# Altium schematic sheet CLKs.SchDoc: CLKs
size 420 x 297 mm; Organization: Altium Limited; Address1: L3, 12a Rodborough Rd; Address2: Frenchs Forest; Address3: NSW; Address4: Australia 2086; DocumentNumber: 13; SheetNumber: 8; SheetTotal: 15
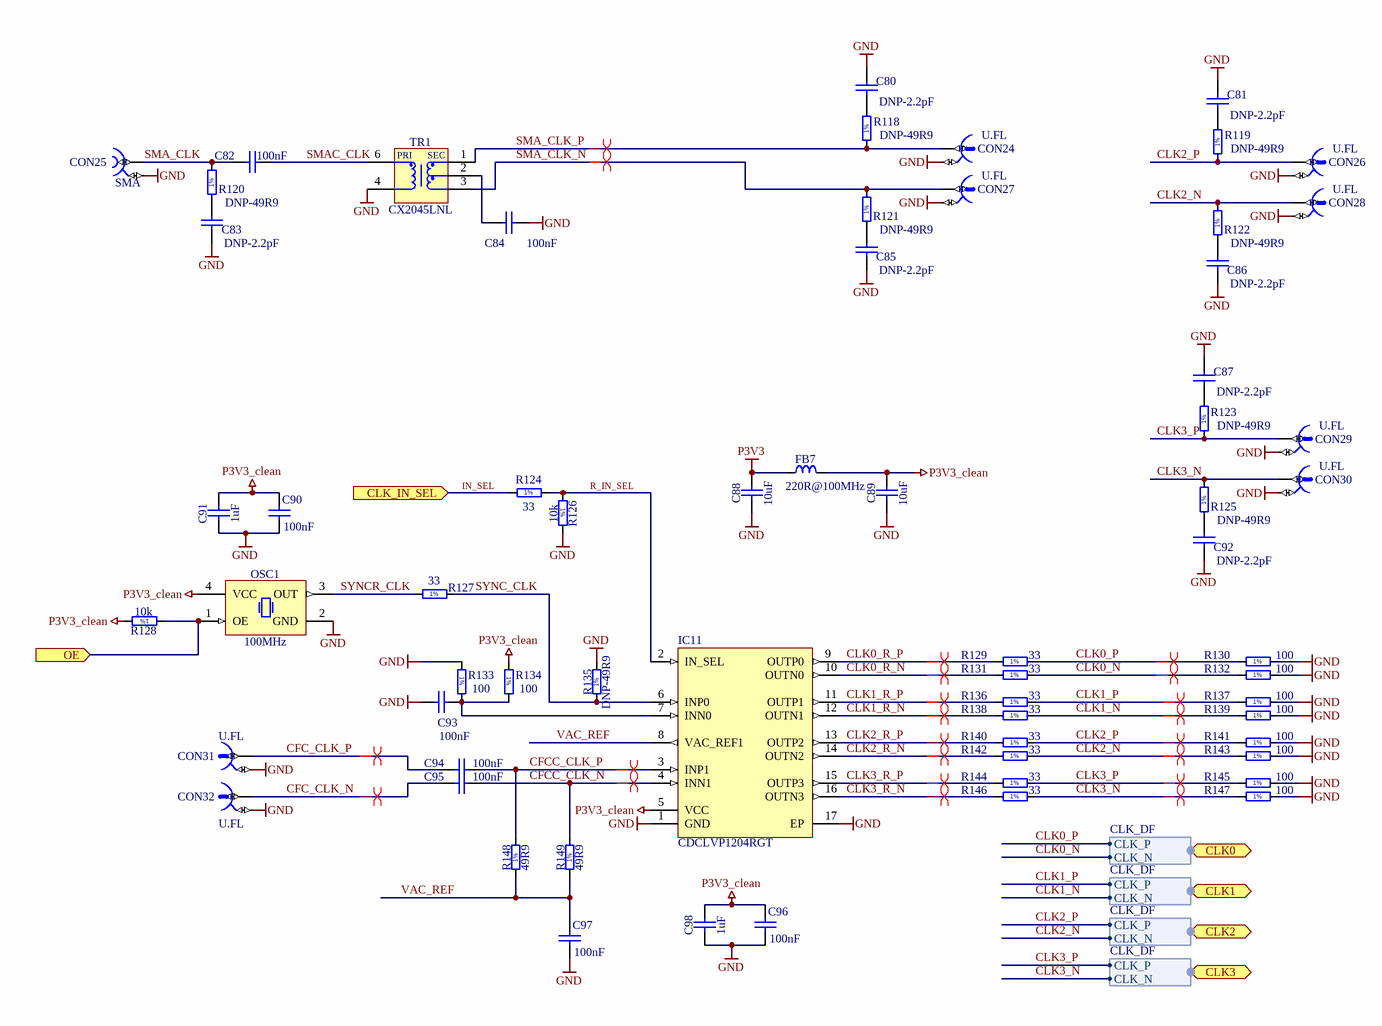
[diagram p0: CLKs.SchDoc]

## Parts
C80  DNP-2.2pF  [CAPC1005X55N]
C81  DNP-2.2pF  [CAPC1005X55N]
C82  100nF  [CAPC0603X33N]
C83  DNP-2.2pF  [CAPC1005X55N]
C84  100nF  [CAPC0603X33N]
C85  DNP-2.2pF  [CAPC1005X55N]
C86  DNP-2.2pF  [CAPC1005X55N]
C87  DNP-2.2pF  [CAPC1005X55N]
C88  10uF  [CAPC2012X135N]
C89  10uF  [CAPC2012X135N]
C90  100nF  [CAPC0603X33N]
C91  1uF  [CAPC1608X87N]
C92  DNP-2.2pF  [CAPC1005X55N]
C93  100nF  [CAPC1005X55N]
C94  100nF  [CAPC0603X33N]
C95  100nF  [CAPC0603X33N]
C96  100nF  [CAPC0603X33N]
C97  100nF  [CAPC1005X55N]
C98  1uF  [CAPC1608X87N]
CON24  U.FL  [HIROSE_U.FL-R-SMT-1(10)]
CON25  SMA  [HUBER-SUHNER_85 SMA-50-0-101/111 NE]
CON26  U.FL  [HIROSE_U.FL-R-SMT-1(10)]
CON27  U.FL  [HIROSE_U.FL-R-SMT-1(10)]
CON28  U.FL  [HIROSE_U.FL-R-SMT-1(10)]
CON29  U.FL  [HIROSE_U.FL-R-SMT-1(10)]
CON30  U.FL  [HIROSE_U.FL-R-SMT-1(10)]
CON31  U.FL  [HIROSE_U.FL-R-SMT-1(10)]
CON32  U.FL  [HIROSE_U.FL-R-SMT-1(10)]
FB7  220R@100MHz  [INDC2012X105N]
IC11  CDCLVP1204RGT  [QFN50P300X300X100-17N-S165]
OSC1  100MHz  [OSC_EPSON_SG-8002CA]
R118  DNP-49R9  [RESC1005X40N]
R119  DNP-49R9  [RESC1005X40N]
R120  DNP-49R9  [RESC1005X40N]
R121  DNP-49R9  [RESC1005X40N]
R122  DNP-49R9  [RESC1005X40N]
R123  DNP-49R9  [RESC1005X40N]
R124  33  [RESC1005X40N]
R125  DNP-49R9  [RESC1005X40N]
R126  10k  [RESC1005X40N]
R127  33  [RESC1005X40N]
R128  10k  [RESC1005X40N]
R129  33  [RESC1005X40N]
R130  100  [RESC1005X40N]
R131  33  [RESC1005X40N]
R132  100  [RESC1005X40N]
R133  100  [RESC1005X40N]
R134  100  [RESC1005X40N]
R135  DNP-49R9  [RESC1005X40N]
R136  33  [RESC1005X40N]
R137  100  [RESC1005X40N]
R138  33  [RESC1005X40N]
R139  100  [RESC1005X40N]
R140  33  [RESC1005X40N]
R141  100  [RESC1005X40N]
R142  33  [RESC1005X40N]
R143  100  [RESC1005X40N]
R144  33  [RESC1005X40N]
R145  100  [RESC1005X40N]
R146  33  [RESC1005X40N]
R147  100  [RESC1005X40N]
R148  49R9  [RESC1005X40N]
R149  49R9  [RESC1005X40N]
TR1  CX2045LNL  [PULSE_CX2045LNL]

## Ports
CLK0 (harness CLK_DF), CLK1 (harness CLK_DF), CLK2 (harness CLK_DF), CLK3 (harness CLK_DF), CLK_IN_SEL (in), OE (in)

## Harnesses
CLK_DF: CLK_P, CLK_N

## Nets
GND: C80.2 C81.2 C83.2 C84.1 C85.2 C86.2 C87.2 C88.1 C89.1 C90.1 C91.1 C92.2 C93.1 C96.1 C97.1 C98.1 CON24.2 CON25.2 CON26.2 CON27.2 CON28.2 CON29.2 CON30.2 CON31.2 CON32.2 IC11.1(GND) IC11.17(EP) OSC1.2(GND) R126.2 R130.2 R132.2 R133.1 R135.2 R137.2 R139.2 R141.2 R143.2 R145.2 R147.2 TR1.4
P3V3: C88.2 FB7.1
P3V3_clean: C89.2 C90.2 C91.2 C96.2 C98.2 FB7.2 IC11.5(VCC) OSC1.4(VCC) R128.2 R134.1
CFC_CLK_N: C95.2 CON32.1
CFC_CLK_P: C94.2 CON31.1
CFCC_CLK_N: C95.1 IC11.4(INN1) R149.2
CFCC_CLK_P: C94.1 IC11.3(INP1) R148.2
CLK0_N: R131.2 R132.1 ; port CLK0.CLK_N
CLK0_P: R129.2 R130.1 ; port CLK0.CLK_P
CLK0_R_N: IC11.10(OUTN0) R131.1
CLK0_R_P: IC11.9(OUTP0) R129.1
CLK1_N: R138.2 R139.1 ; port CLK1.CLK_N
CLK1_P: R136.2 R137.1 ; port CLK1.CLK_P
CLK1_R_N: IC11.12(OUTN1) R138.1
CLK1_R_P: IC11.11(OUTP1) R136.1
CLK2_N: CON28.1 R122.2 R142.2 R143.1 ; port CLK2.CLK_N
CLK2_P: CON26.1 R119.1 R140.2 R141.1 ; port CLK2.CLK_P
CLK2_R_N: IC11.14(OUTN2) R142.1
CLK2_R_P: IC11.13(OUTP2) R140.1
CLK3_N: CON30.1 R125.2 R146.2 R147.1 ; port CLK3.CLK_N
CLK3_P: CON29.1 R123.1 R144.2 R145.1 ; port CLK3.CLK_P
CLK3_R_N: IC11.16(OUTN3) R146.1
CLK3_R_P: IC11.15(OUTP3) R144.1
IN_SEL: R124.1 ; port CLK_IN_SEL
OE: OSC1.1(OE) R128.1 ; port OE
R_IN_SEL: IC11.2(IN_SEL) R124.2 R126.1
SMA_CLK: C82.2 CON25.1 R120.2
SMA_CLK_N: CON27.1 R121.2 TR1.3
SMA_CLK_P: CON24.1 R118.1 TR1.1
SMAC_CLK: C82.1 TR1.6
SYNC_CLK: IC11.6(INP0) R127.2 R135.1
SYNCR_CLK: OSC1.3(OUT) R127.1
VAC_REF: C97.2 IC11.8(VAC_REF1) R148.1 R149.1
NetC80_1: C80.1 R118.2
NetC81_1: C81.1 R119.2
NetC83_1: C83.1 R120.1
NetC84_2: C84.2 TR1.2
NetC85_1: C85.1 R121.1
NetC86_1: C86.1 R122.1
NetC87_1: C87.1 R123.2
NetC92_1: C92.1 R125.1
NetC93_2: C93.2 IC11.7(INN0) R133.2 R134.2

## Layout directives
differential pair: CFC_CLK_N, CFC_CLK_P, CFCC_CLK_N, CFCC_CLK_P, CLK0_N, CLK0_P, CLK0_R_N, CLK0_R_P, CLK1_N, CLK1_P, CLK1_R_N, CLK1_R_P, CLK2_N, CLK2_P, CLK2_R_N, CLK2_R_P, CLK3_N, CLK3_P, CLK3_R_N, CLK3_R_P, SMA_CLK_N, SMA_CLK_P

## Notes on the sheet
- Project/Equipment
- Document
- uTCA RTM 8 SFP+
- Designer
- Drawn by
- Check.by
- Copyright Creotech Instruments SA 2014.
  This documentation describes Open Hardware and is licensed under the CERN OHL v.1.1. You may redistribute and modify this documentation under the terms of the CERN OHL v.1.1. (http://ohwr.org/CERNOHL). This documentation is distributed WITHOUT ANY EXPRESS OR IMPLIED WARRANTY, INCLUDING OF MERCHANTABILITY, SATISFACTORY QUALITY AND FITNESS FOR A PARTICULAR PURPOSE. Please see the CERN OHL v.1.1 for applicable conditions.
- Creotech Instruments S.A.
- File
- Last Mod.
- Print Date
- Sheet
- Size
- A3
- of
- Rev
- (in symbol PULSE_CX2045LNL) PRI; SEC
- (in symbol R0402_10K_1%_0.0625W_100PPM) 1%
- (in symbol R0402_33R_1%_0.0625W_100PPM) 1%
- (in symbol R0402_49R9_1%_0.0625W_100PPM) 1%
- (in symbol R0402_100R_1%_0.0625W_100PPM) 1%

## Library data of the parts
C80 C81 C83 C85-C87 C92 = CC0402_2.2PF_50V_0.25PF_NP0: Non-polarised capacitor; Part Description: SMD Multilayer Chip Ceramic Capacitor; Manufacturer: GENERIC; Manufacturer1 Part Number: 223886915228; Voltage: 50V; TC: NP0; Tolerance: ±0.25pF; Table: Capacitors SMD; Part Number: CC0402_2.2PF_50V_0.25PF_NP0; Component Kind: Standard; Component Type: Standard; Pin Count: 2; Value: DNP-2.2pF; Status: Not Recommended; Manufacturer Part Number: CC0402_2.2PF_50V_0.25PF_NP0; Case: 0402; Mounted: Yes; Socket: No; SMD: Yes; Manufacturer1 Example: PHYCOMP; Manufacturer1 ComponentHeight: 0.55mm; HelpURL: \\cern.ch\dfs\Applications\Altium\Datasheets\CC0402_NP0_PHYCOMP.pdf; Author: CERN DEM JLC; CreateDate: 2007-12-03; LatestRevisionDate: 2007-12-03
C82 C84 C90 C94-C96 = CC0201_100NF_6.3V_10%_X5R: Non-polarised capacitor; Part Description: SMD Multilayer Chip Ceramic Capacitor; Manufacturer: GENERIC; Manufacturer1 Part Number: 02016D104KAT2A; Voltage: 6.3V; TC: X5R; Tolerance: ±10%; Table: Capacitors SMD; Part Number: CC0201_100NF_6.3V_10%_X5R; Component Kind: Standard; Component Type: Standard; Pin Count: 2; Value: 100nF; Status: Not Recommended; Manufacturer Part Number: CC0201_100NF_6.3V_10%_X5R; Case: 0201; Mounted: Yes; Socket: No; SMD: Yes; Manufacturer1 Example: AVX; Manufacturer1 ComponentHeight: 0.33mm; HelpURL: \\cern.ch\dfs\Applications\Altium\Datasheets\CC0201_X5R_AVX.pdf; Author: CERN DEM JLC; CreateDate: 2007-12-03; LatestRevisionDate: 2007-12-03
C88 C89 = CC0805_10UF_10V_10%_X7R: Non-polarised capacitor; Part Description: SMD Multilayer Chip Ceramic Capacitor; Manufacturer: GENERIC; Manufacturer1 Part Number: GRM21BR71A106KE51L; Voltage: 10V; TC: X7R; Tolerance: ±10%; Table: Capacitors SMD; Part Number: CC0805_10UF_10V_10%_X7R; Component Kind: Standard; Component Type: Standard; Pin Count: 2; Value: 10uF; Status: Preferred; Manufacturer Part Number: CC0805_10UF_10V_10%_X7R; Case: 0805; Mounted: Yes; Socket: No; SMD: Yes; Manufacturer1 Example: MURATA; Manufacturer1 ComponentHeight: 1.35mm; HelpURL: \\cern.ch\dfs\Applications\Altium\Datasheets\CC0805_X7R_MURATA.pdf; Author: CERN DEM JLC; CreateDate: 2012-04-30; LatestRevisionDate: 2012-04-30
C91 C98 = CC0603_1UF_25V_10%_X7R: Non-polarised capacitor; Part Description: SMD Multilayer Chip Ceramic Capacitor; Manufacturer: GENERIC; Manufacturer1 Part Number: GRM188R71E105KA12D; Voltage: 25V; TC: X7R; Tolerance: ±10%; Table: Capacitors SMD; Part Number: CC0603_1UF_25V_10%_X7R; Component Kind: Standard; Component Type: Standard; Pin Count: 2; Value: 1uF; Status: None; Manufacturer Part Number: CC0603_1UF_25V_10%_X7R; Case: 0603; Mounted: Yes; Socket: No; SMD: Yes; Manufacturer1 Example: MURATA; Manufacturer1 ComponentHeight: 0.9mm; HelpURL: \\cern.ch\dfs\Applications\Altium\Datasheets\CC0603_X7R_MURATA.pdf; Author: CERN DEM JLC; CreateDate: 2011-01-18; LatestRevisionDate: 2011-01-18
C93 C97 = CC0402_100NF_16V_10%_X7R: Non-polarised capacitor; Part Description: SMD Multilayer Chip Ceramic Capacitor; Manufacturer: GENERIC; Manufacturer1 Part Number: 223878715649; Voltage: 16V; TC: X7R; Tolerance: ±10%; Table: Capacitors SMD; Part Number: CC0402_100NF_16V_10%_X7R; Component Kind: Standard; Component Type: Standard; Pin Count: 2; Value: 100nF; Status: Not Recommended; Manufacturer Part Number: CC0402_100NF_16V_10%_X7R; Case: 0402; Mounted: Yes; Socket: No; SMD: Yes; Manufacturer1 Example: PHYCOMP; Manufacturer1 ComponentHeight: 0.55mm; HelpURL: \\cern.ch\dfs\Applications\Altium\Datasheets\CC0402_X7R_PHYCOMP.pdf; Author: CERN DEM JLC; CreateDate: 2007-12-03; LatestRevisionDate: 2007-12-03
CON24 CON26-CON32 = HIROSE_U.FL-R-SMT-1(10): Part Description: Up to 6GHz Ultra Small Surface Mount Male Coaxial Connectors U.FL Series; Manufacturer: HIROSE (HRS); Table: Miscellaneous; Part Number: HIROSE_U.FL-R-SMT-1(10); Component Kind: Standard; Component Type: Standard; Pin Count: 2; Family: U.FL; Mounted: Yes; Socket: No; SMD: Yes; Status: None; Manufacturer Part Number: U.FL-R-SMT-1(10); ComponentHeight: 1.25mm; HelpURL: \\cern.ch\dfs\Applications\Altium\Datasheets\HIROSE_U.FL-R-SMT-1(10).pdf; Author: CERN DEM JLC; CreateDate: 2010-03-24; LatestRevisionDate: 2010-03-24
CON25 = HUBER-SUHNER_85_SMA-50-0-101/111_NE: Part Description: SMA 50 Ohms Right Angle PCB Jack; Manufacturer: HUBER+SUHNER; Table: Miscellaneous; Part Number: HUBER-SUHNER_85_SMA-50-0-101/111_NE; Component Kind: Standard; Component Type: Standard; Pin Count: 2; Family: SMA; Mounted: Yes; Socket: No; SMD: No; Status: None; Manufacturer Part Number: 85_SMA-50-0-101/111_NE; ComponentHeight: 9.6mm; HelpURL: \\cern.ch\dfs\Applications\Altium\Datasheets\HUBER-SUHNER_85 SMA-50-0-101-111 NE.pdf; Author: CERN DEM JLC; CreateDate: 2010-04-20; LatestRevisionDate: 2010-04-27
FB7 = IND0805_MURATA_BLM21PG221SN1D: Inductor; Part Description: SMD EMIFIL Suppression Chip Ferrite Bead; Manufacturer: MURATA; Power: 2A; Resistance: 0.05R; Tolerance: ±25%; Table: Inductors SMD; Part Number: IND0805_MURATA_BLM21PG221SN1D; Component Kind: Standard; Component Type: Standard; Pin Count: 2; Value: 220R@100MHz; Status: None; Manufacturer Part Number: BLM21PG221SN1D; Case: 0805; Mounted: Yes; Socket: No; SMD: Yes; ComponentHeight: 1.05mm; HelpURL: \\cern.ch\dfs\Applications\Altium\Datasheets\IND0402_MURATA_BLM21P.pdf; Author: CERN DEM JLC; CreateDate: 2010-01-25; LatestRevisionDate: 2010-01-25
IC11 = CDCLVP1204RGT: 2:2 Low Additive Jitter LVPECL Buffer
OSC1 = OSC_100MHZ_EPSON_SG-8002CAPCB100MHZ: Oscillator 4 pins 1=OE 2=GND 3=OUT 4=VCC; Part Description: 3.3V ±50ppm 15pF -40..85°C, Output Enable Function , Surface Mount Crystal Oscillator (SG-8002CA Serie); Manufacturer: EPSON-TOYOCOM; Table: Crystals & Oscillators; Part Number: OSC_100MHZ_EPSON_SG-8002CAPCB100MHZ; Component Kind: Standard; Component Type: Standard; PackageDescription: SMD Oscillator, Side Convave, 4 pins, 5.00x7.00mm SG-8002CA Serie; Value: 100MHz; Manufacturer Part Number: SG-8002CA PCB 100MHZ; Pin Count: 4; Mounted: Yes; Socket: No; SMD: Yes; ComponentHeight: 1.5mm; HelpURL: \\cern.ch\dfs\Applications\Altium\Datasheets\OSC_EPSON_SG-8002CA.pdf; Author: CERN DEM JLC; CreateDate: 2011-05-02; LatestRevisionDate: 2011-05-02
R118-R123 R125 R135 R148 R149 = R0402_49R9_1%_0.0625W_100PPM: Resistor - 1%; Part Description: General Purpose Thick Film Chip Resistor; Manufacturer: GENERIC; Manufacturer1 Part Number: 232270674999L or RC0402FR-0749R9L; TC: ±100ppm/°C; Table: Resistors SMD; Part Number: R0402_49R9_1%_0.0625W_100PPM; Component Kind: Standard; Component Type: Standard; Pin Count: 2; Status: Not recommended; Power: 0.0625W; Tolerance: ±1%; Manufacturer Part Number: R0402_49R9_1%_0.0625W_100PPM; Case: 0402; Mounted: Yes; Socket: No; SMD: Yes; Manufacturer1 Example: YAGEO PHYCOMP; Manufacturer1 ComponentHeight: 0.4mm; HelpURL: \\cern.ch\dfs\Applications\Altium\Datasheets\R0402_Phycomp_RC0402.pdf; Author: CERN DEM JLC; CreateDate: 2012-10-24; LatestRevisionDate: 2012-10-24
  R118-R123 R125 R135: Value: DNP-49R9
  R148 R149: Value: 49R9
R124 R127 R129 R131 R136 R138 R140 R142 R144 R146 = R0402_33R_1%_0.0625W_100PPM: Resistor - 1%; Part Description: General Purpose Thick Film Chip Resistor; Manufacturer: GENERIC; Manufacturer1 Part Number: 232270673309L; TC: ±100ppm/°C; Table: Resistors SMD; Part Number: R0402_33R_1%_0.0625W_100PPM; Component Kind: Standard; Component Type: Standard; Pin Count: 2; Value: 33; Status: Not recommended; Power: 0.0625W; Tolerance: ±1%; Manufacturer Part Number: R0402_33R_1%_0.0625W_100PPM; Case: 0402; Mounted: Yes; Socket: No; SMD: Yes; Manufacturer1 Example: YAGEO PHYCOMP; Manufacturer1 ComponentHeight: 0.4mm; HelpURL: \\cern.ch\dfs\Applications\Altium\Datasheets\R0402_Phycomp_RC0402.pdf; Author: CERN DEM JLC; CreateDate: 2007-12-03; LatestRevisionDate: 2012-10-17
R126 R128 = R0402_10K_1%_0.0625W_100PPM: Resistor - 1%; Part Description: General Purpose Thick Film Chip Resistor; Manufacturer: GENERIC; Manufacturer1 Part Number: 232270671003L; TC: ±100ppm/°C; Table: Resistors SMD; Part Number: R0402_10K_1%_0.0625W_100PPM; Component Kind: Standard; Component Type: Standard; Pin Count: 2; Value: 10k; Status: Not recommended; Power: 0.0625W; Tolerance: ±1%; Manufacturer Part Number: R0402_10K_1%_0.0625W_100PPM; Case: 0402; Mounted: Yes; Socket: No; SMD: Yes; Manufacturer1 Example: YAGEO PHYCOMP; Manufacturer1 ComponentHeight: 0.4mm; HelpURL: \\cern.ch\dfs\Applications\Altium\Datasheets\R0402_Phycomp_RC0402.pdf; Author: CERN DEM JLC; CreateDate: 2007-12-03; LatestRevisionDate: 2012-10-17
R130 R132-R134 R137 R139 R141 R143 R145 R147 = R0402_100R_1%_0.0625W_100PPM: Resistor - 1%; Part Description: General Purpose Thick Film Chip Resistor; Manufacturer: GENERIC; Manufacturer1 Part Number: 232270671001L; TC: ±100ppm/°C; Table: Resistors SMD; Part Number: R0402_100R_1%_0.0625W_100PPM; Component Kind: Standard; Component Type: Standard; Pin Count: 2; Value: 100; Status: Not recommended; Power: 0.0625W; Tolerance: ±1%; Manufacturer Part Number: R0402_100R_1%_0.0625W_100PPM; Case: 0402; Mounted: Yes; Socket: No; SMD: Yes; Manufacturer1 Example: YAGEO PHYCOMP; Manufacturer1 ComponentHeight: 0.4mm; HelpURL: \\cern.ch\dfs\Applications\Altium\Datasheets\R0402_Phycomp_RC0402.pdf; Author: CERN DEM JLC; CreateDate: 2007-12-03; LatestRevisionDate: 2012-10-17
TR1 = PULSE_CX2045LNL: Balun (Ruthroff Balun Transformer) Impedance - Unbalanced/Balanced 1:2 (1:1.41 Turn Ratio)